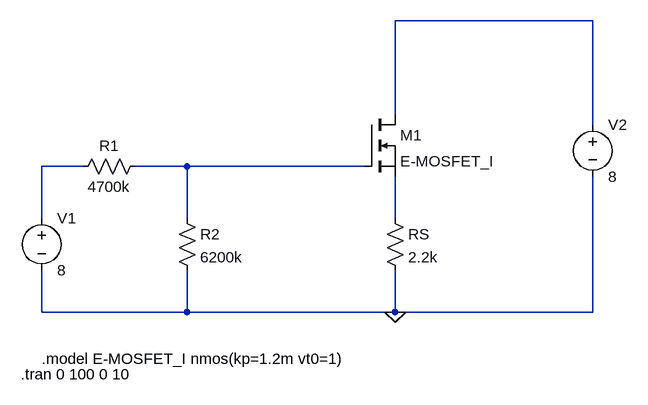
[diagram p0: schematic Exercicio 37.asc]
Exercicio 37.asc, the LTspice schematic file:
Version 4
SHEET 1 880 680
WIRE 720 -144 416 -144
WIRE 416 0 416 -144
WIRE 720 16 720 -144
WIRE -64 80 -128 80
WIRE 96 80 16 80
WIRE 368 80 96 80
WIRE -128 160 -128 80
WIRE 96 160 96 80
WIRE 416 160 416 96
WIRE -128 304 -128 240
WIRE 96 304 96 240
WIRE 96 304 -128 304
WIRE 416 304 416 240
WIRE 416 304 96 304
WIRE 720 304 720 96
WIRE 720 304 416 304
FLAG 416 304 0
SYMBOL voltage 720 0 R0
WINDOW 123 0 0 Left 0
WINDOW 39 0 0 Left 0
SYMATTR InstName V2
SYMATTR Value 8
SYMBOL res 400 144 R0
SYMATTR InstName RS
SYMATTR Value 2.2k
SYMBOL nmos 368 0 R0
SYMATTR InstName M1
SYMATTR Value E-MOSFET_I
SYMBOL voltage -128 144 R0
WINDOW 123 0 0 Left 0
WINDOW 39 0 0 Left 0
SYMATTR InstName V1
SYMATTR Value 8
SYMBOL res 80 144 R0
SYMATTR InstName R2
SYMATTR Value 6200k
SYMBOL res 32 64 R90
WINDOW 0 0 56 VBottom 2
WINDOW 3 32 56 VTop 2
SYMATTR InstName R1
SYMATTR Value 4700k
TEXT -128 376 Left 2 !.model E-MOSFET_I nmos(kp=1.2m vt0=1)
TEXT -160 400 Left 2 !.tran 0 100 0 10

The netlist it stands for:
* Exercicio 37.asc
V2 N001 0 8
RS N004 0 2.2k
M1 N001 N003 N004 N004 E-MOSFET_I
V1 N002 0 8
R2 N003 0 6200k
R1 N003 N002 4700k
.model NMOS NMOS
.model PMOS PMOS
.lib standard.mos
.model E-MOSFET_I nmos(kp=1.2m vt0=1)
.tran 0 100 0 10
.backanno
.end